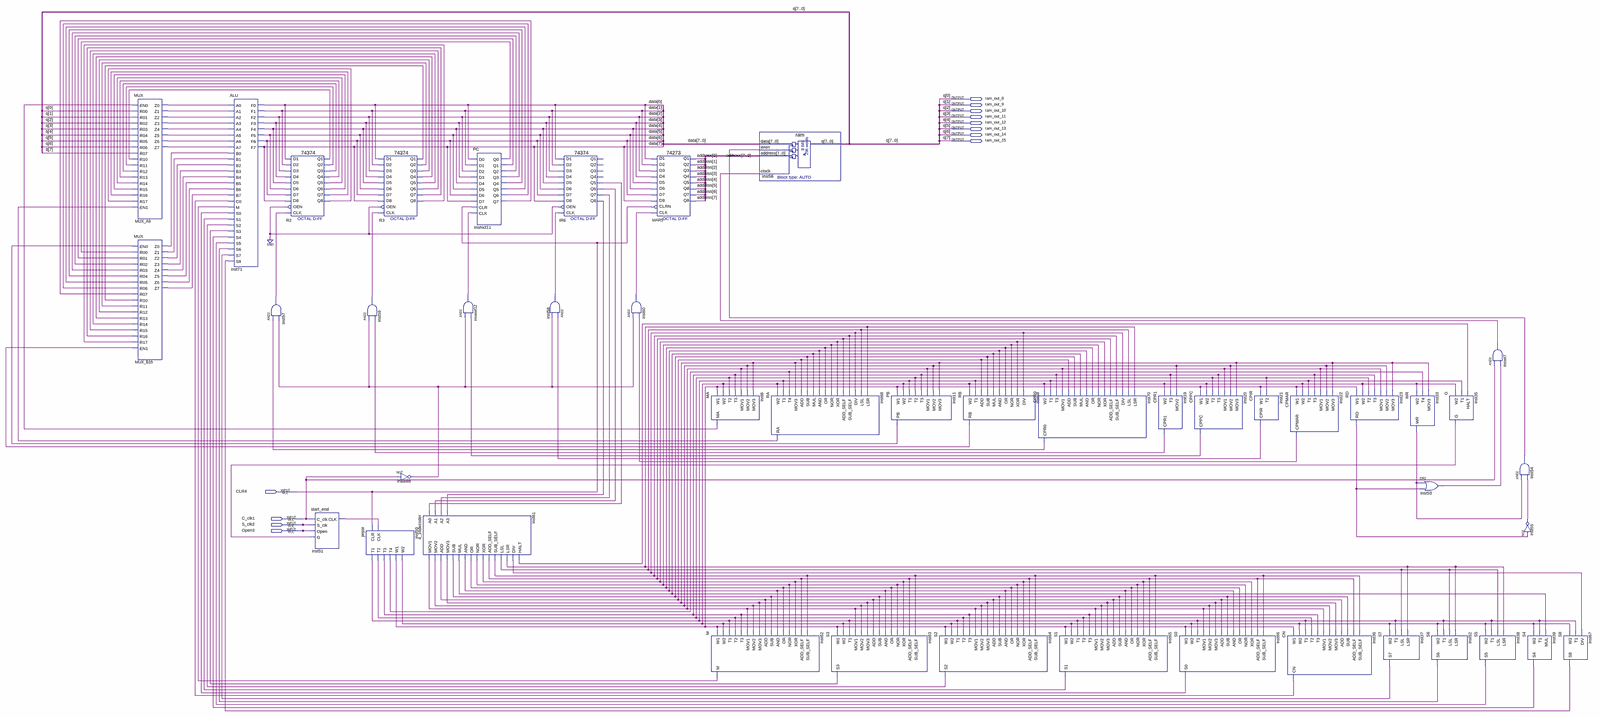
[diagram p0: schematic sheet, whole]
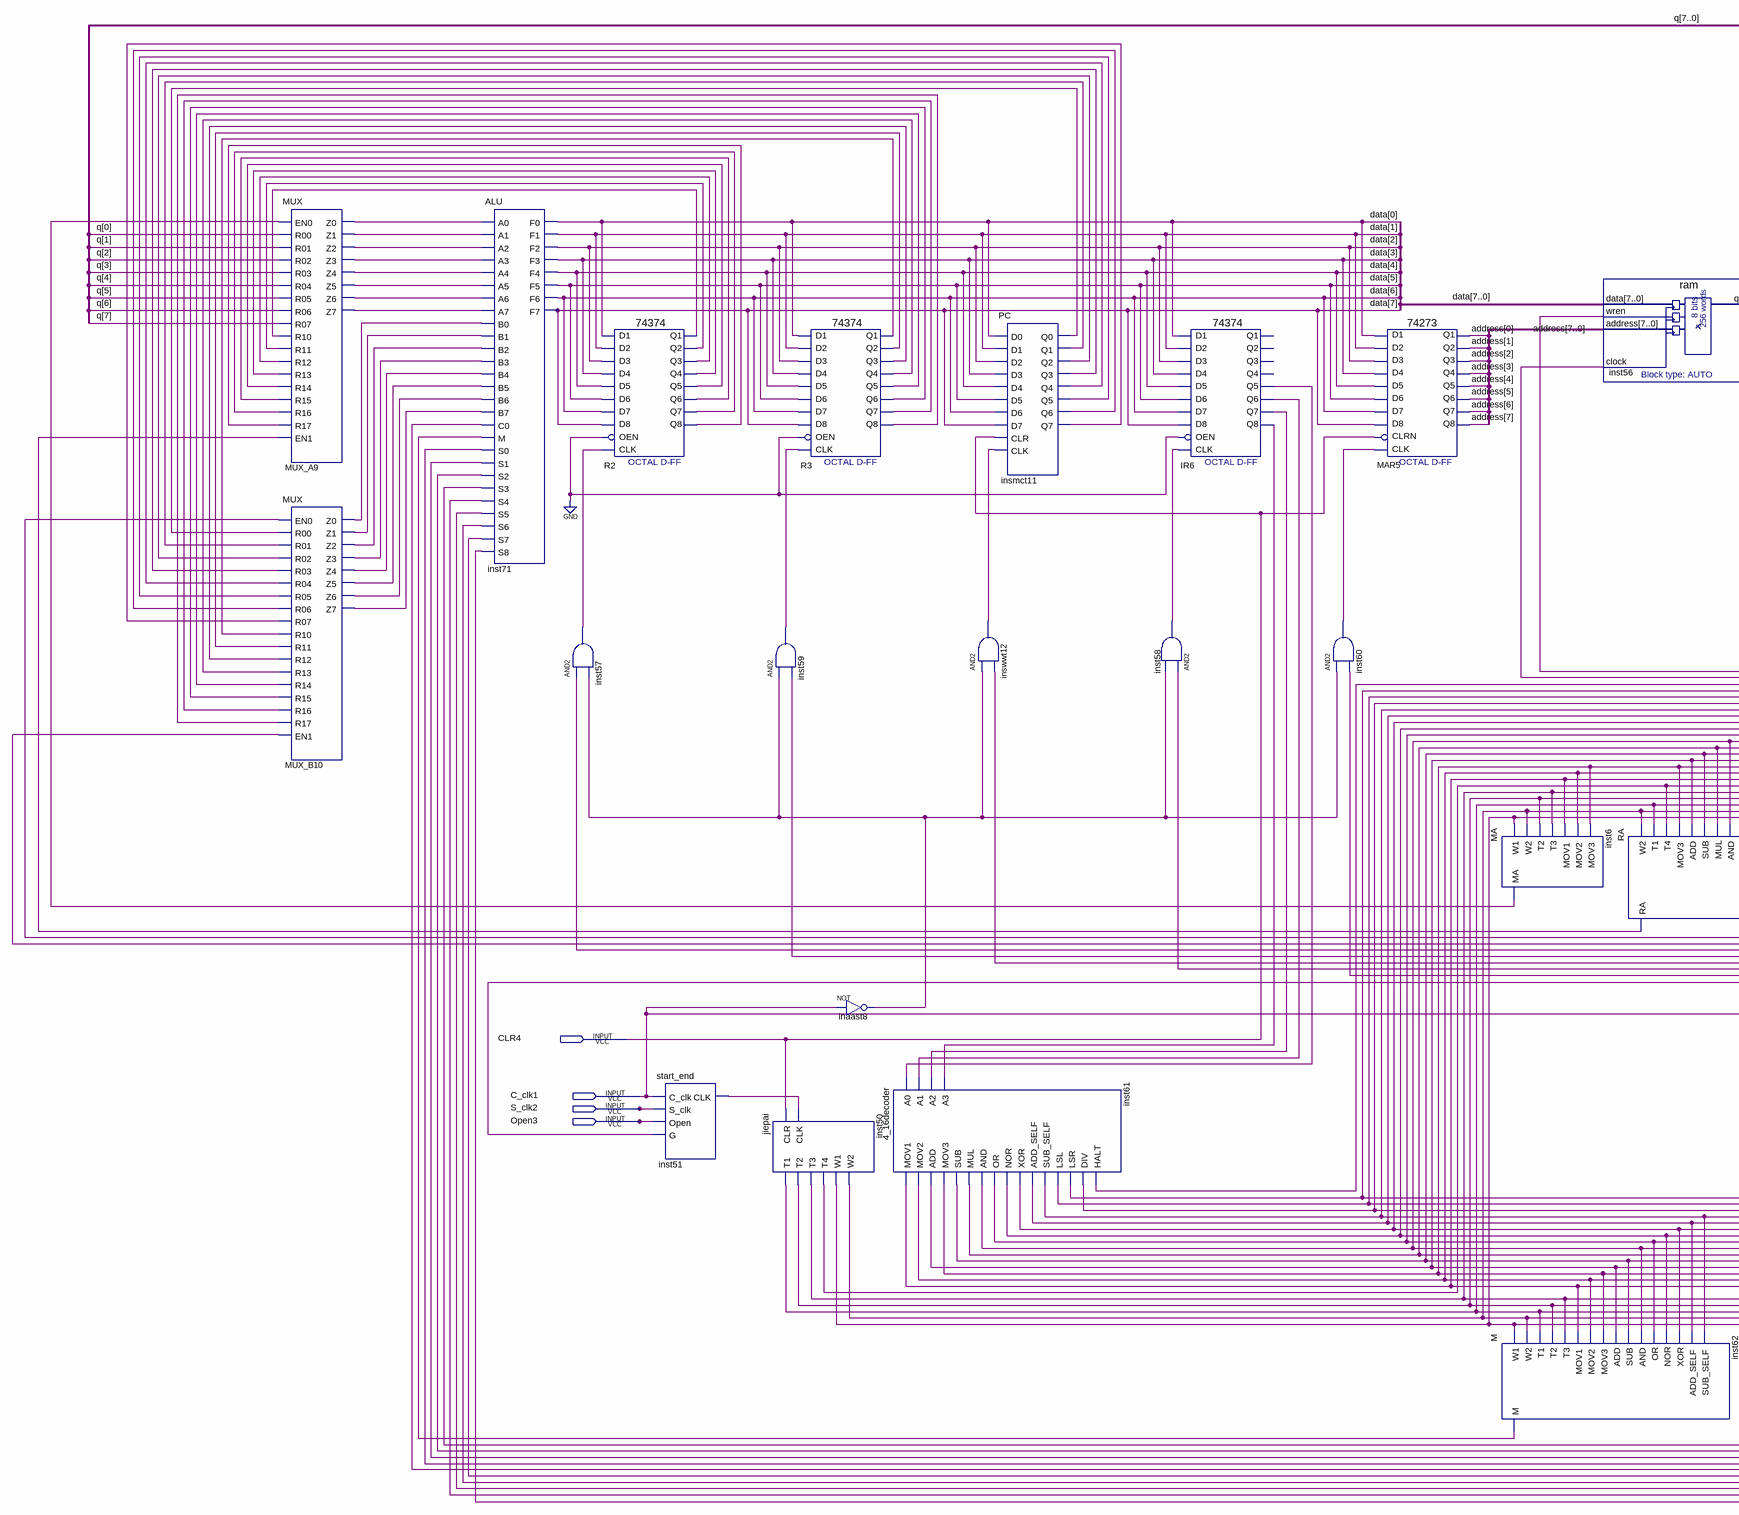
[diagram p1: schematic sheet, left part]
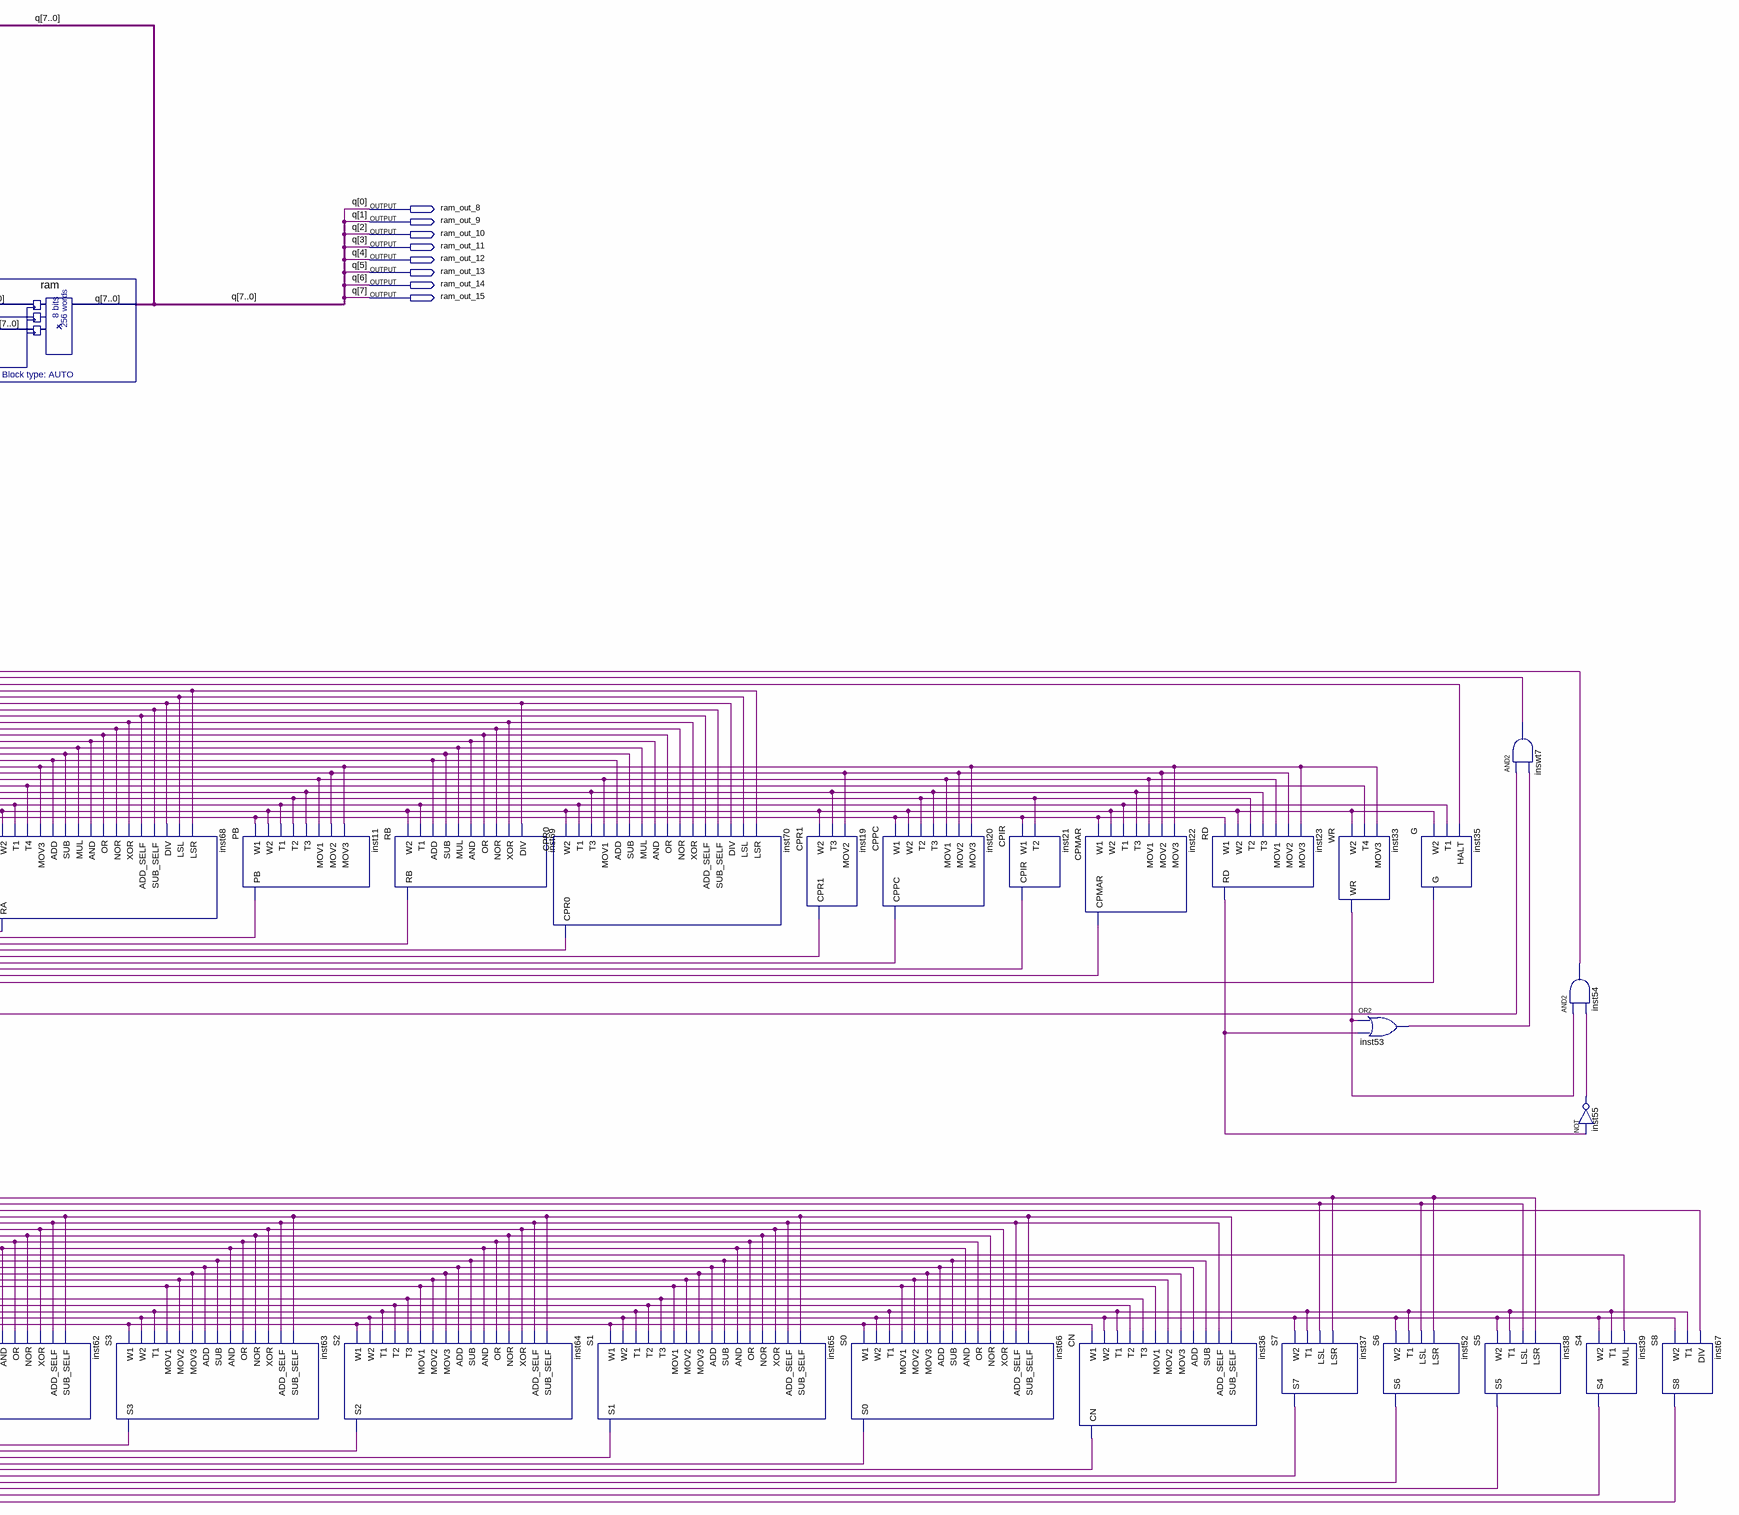
[diagram p2: schematic sheet, right part]
// Quartus schematic Block1.bdf as structural Verilog: 45 symbols, 12 pins
module Block1 (
  input  CLR4,
  input  C_clk1,
  input  S_clk2,
  input  Open3,
  output ram_out_8,
  output ram_out_9,
  output ram_out_10,
  output ram_out_11,
  output ram_out_12,
  output ram_out_13,
  output ram_out_14,
  output ram_out_15
);

  wire inaast8_out, insmct11_q0, insmct11_q1, insmct11_q2, insmct11_q3, insmct11_q4, insmct11_q5,
       insmct11_q6, insmct11_q7, inst6_ma, inst11_pb, inst19_cpr1, inst20_cppc, inst21_cpir, inst22_cpmar,
       inst23_rd, inst33_wr, inst35_g, inst36_cn, inst37_s7, inst38_s5, inst39_s4, inst50_t1, inst50_t2,
       inst50_t3, inst50_t4, inst50_w1, inst50_w2, inst51_clk, inst52_s6, inst53_out, inst54_out, inst55_out,
       inst57_out, inst58_out, inst59_out, inst60_out, inst61_add, inst61_add_self, inst61_and, inst61_div,
       inst61_halt, inst61_lsl, inst61_lsr, inst61_mov1, inst61_mov2, inst61_mov3, inst61_mul, inst61_nor,
       inst61_or, inst61_sub, inst61_sub_self, inst61_xor, inst62_m, inst63_s3, inst64_s2, inst65_s1,
       inst66_s0, inst67_s8, inst68_ra, inst69_rb, inst70_cpr0, inswt7_out, inswwt12_out, IR6_q5, IR6_q6,
       IR6_q7, IR6_q8, MUX_A9_z0, MUX_A9_z1, MUX_A9_z2, MUX_A9_z3, MUX_A9_z4, MUX_A9_z5, MUX_A9_z6,
       MUX_A9_z7, MUX_B10_z0, MUX_B10_z1, MUX_B10_z2, MUX_B10_z3, MUX_B10_z4, MUX_B10_z5, MUX_B10_z6,
       MUX_B10_z7, R2_q1, R2_q2, R2_q3, R2_q4, R2_q5, R2_q6, R2_q7, R2_q8, R3_q1, R3_q2, R3_q3, R3_q4, R3_q5,
       R3_q6, R3_q7, R3_q8;
  wire [7:0] address, data;

  MUX MUX_A9 (
    .EN0(inst6_ma), .R00(ram_out_8), .R01(ram_out_9), .R02(ram_out_10), .R03(ram_out_11), .R04(ram_out_12),
    .R05(ram_out_13), .R06(ram_out_14), .R07(ram_out_15), .R10(R2_q1), .R11(R2_q2), .R12(R2_q3), .R13(R2_q4),
    .R14(R2_q5), .R15(R2_q6), .R16(R2_q7), .R17(R2_q8), .EN1(inst68_ra), .Z0(MUX_A9_z0), .Z1(MUX_A9_z1),
    .Z2(MUX_A9_z2), .Z3(MUX_A9_z3), .Z4(MUX_A9_z4), .Z5(MUX_A9_z5), .Z6(MUX_A9_z6), .Z7(MUX_A9_z7));
  MUX MUX_B10 (
    .EN0(inst11_pb), .R00(insmct11_q0), .R01(insmct11_q1), .R02(insmct11_q2), .R03(insmct11_q3),
    .R04(insmct11_q4), .R05(insmct11_q5), .R06(insmct11_q6), .R07(insmct11_q7), .R10(R3_q1), .R11(R3_q2),
    .R12(R3_q3), .R13(R3_q4), .R14(R3_q5), .R15(R3_q6), .R16(R3_q7), .R17(R3_q8), .EN1(inst69_rb),
    .Z0(MUX_B10_z0), .Z1(MUX_B10_z1), .Z2(MUX_B10_z2), .Z3(MUX_B10_z3), .Z4(MUX_B10_z4), .Z5(MUX_B10_z5),
    .Z6(MUX_B10_z6), .Z7(MUX_B10_z7));
  ALU inst71 (
    .A0(MUX_A9_z0), .A1(MUX_A9_z1), .A2(MUX_A9_z2), .A3(MUX_A9_z3), .A4(MUX_A9_z4), .A5(MUX_A9_z5),
    .A6(MUX_A9_z6), .A7(MUX_A9_z7), .B0(MUX_B10_z0), .B1(MUX_B10_z1), .B2(MUX_B10_z2), .B3(MUX_B10_z3),
    .B4(MUX_B10_z4), .B5(MUX_B10_z5), .B6(MUX_B10_z6), .B7(MUX_B10_z7), .C0(inst36_cn), .M(inst62_m),
    .S0(inst66_s0), .S1(inst65_s1), .S2(inst64_s2), .S3(inst63_s3), .S4(inst39_s4), .S5(inst38_s5),
    .S6(inst52_s6), .S7(inst37_s7), .S8(inst67_s8), .F0(data[0]), .F1(data[1]), .F2(data[2]), .F3(data[3]),
    .F4(data[4]), .F5(data[5]), .F6(data[6]), .F7(data[7]));
  \74374  R2 (
    .D1(data[0]), .D2(data[1]), .D3(data[2]), .D4(data[3]), .D6(data[5]), .D5(data[4]), .OEN(1'b0),
    .D8(data[7]), .D7(data[6]), .CLK(inst57_out), .Q2(R2_q2), .Q3(R2_q3), .Q5(R2_q5), .Q4(R2_q4), .Q6(R2_q6),
    .Q7(R2_q7), .Q8(R2_q8), .Q1(R2_q1));
  and inst57 (inst57_out, inst70_cpr0, inaast8_out);
  start_end inst51 (.C_clk(C_clk1), .S_clk(S_clk2), .Open(Open3), .G(inst35_g), .CLK(inst51_clk));
  jiepai inst50 (
    .CLR(CLR4), .CLK(inst51_clk), .T1(inst50_t1), .T2(inst50_t2), .T3(inst50_t3), .T4(inst50_t4),
    .W1(inst50_w1), .W2(inst50_w2));
  \74374  R3 (
    .D1(data[0]), .D2(data[1]), .D3(data[2]), .D4(data[3]), .D6(data[5]), .D5(data[4]), .OEN(1'b0),
    .D8(data[7]), .D7(data[6]), .CLK(inst59_out), .Q2(R3_q2), .Q3(R3_q3), .Q5(R3_q5), .Q4(R3_q4), .Q6(R3_q6),
    .Q7(R3_q7), .Q8(R3_q8), .Q1(R3_q1));
  and inst59 (inst59_out, inaast8_out, inst19_cpr1);
  not inaast8 (inaast8_out, C_clk1);
  \4_16decoder  inst61 (
    .A0(IR6_q5), .A1(IR6_q6), .A2(IR6_q7), .A3(IR6_q8), .MOV1(inst61_mov1), .MOV2(inst61_mov2),
    .ADD(inst61_add), .MOV3(inst61_mov3), .SUB(inst61_sub), .MUL(inst61_mul), .AND(inst61_and),
    .OR(inst61_or), .NOR(inst61_nor), .XOR(inst61_xor), .ADD_SELF(inst61_add_self),
    .SUB_SELF(inst61_sub_self), .LSL(inst61_lsl), .LSR(inst61_lsr), .DIV(inst61_div), .HALT(inst61_halt));
  PC insmct11 (
    .D0(data[0]), .D1(data[1]), .D2(data[2]), .D3(data[3]), .D4(data[4]), .D5(data[5]), .D6(data[6]),
    .D7(data[7]), .CLR(CLR4), .CLK(inswwt12_out), .Q0(insmct11_q0), .Q1(insmct11_q1), .Q2(insmct11_q2),
    .Q3(insmct11_q3), .Q4(insmct11_q4), .Q5(insmct11_q5), .Q6(insmct11_q6), .Q7(insmct11_q7));
  and inswwt12 (inswwt12_out, inaast8_out, inst20_cppc);
  and inst58 (inst58_out, inst21_cpir, inaast8_out);
  \74374  IR6 (
    .D1(data[0]), .D2(data[1]), .D3(data[2]), .D4(data[3]), .D6(data[5]), .D5(data[4]), .OEN(1'b0),
    .D8(data[7]), .D7(data[6]), .CLK(inst58_out), .Q5(IR6_q5), .Q6(IR6_q6), .Q7(IR6_q7), .Q8(IR6_q8));  // open: Q2, Q3, Q4, Q1
  and inst60 (inst60_out, inaast8_out, inst22_cpmar);
  \74273  MAR5 (
    .D2(data[1]), .D3(data[2]), .D1(data[0]), .D4(data[3]), .D7(data[6]), .D6(data[5]), .D5(data[4]),
    .D8(data[7]), .CLK(inst60_out), .CLRN(CLR4), .Q4(address[3]), .Q1(address[0]), .Q2(address[1]),
    .Q3(address[2]), .Q6(address[5]), .Q5(address[4]), .Q7(address[6]), .Q8(address[7]));
  MA inst6 (
    .W1(inst50_w1), .W2(inst50_w2), .T2(inst50_t2), .T3(inst50_t3), .MOV1(inst61_mov1), .MOV2(inst61_mov2),
    .MOV3(inst61_mov3), .MA(inst6_ma));
  M inst62 (
    .W1(inst50_w1), .W2(inst50_w2), .T1(inst50_t1), .T2(inst50_t2), .T3(inst50_t3), .MOV1(inst61_mov1),
    .MOV2(inst61_mov2), .MOV3(inst61_mov3), .ADD(inst61_add), .SUB(inst61_sub), .AND(inst61_and),
    .OR(inst61_or), .NOR(inst61_nor), .XOR(inst61_xor), .ADD_SELF(inst61_add_self),
    .SUB_SELF(inst61_sub_self), .M(inst62_m));
  ram inst56 (
    .data(data), .wren(inst54_out), .address(address), .clock(inswt7_out),
    .q({ram_out_15, ram_out_14, ram_out_13, ram_out_12, ram_out_11, ram_out_10, ram_out_9, ram_out_8}));
  RA inst68 (
    .W2(inst50_w2), .T1(inst50_t1), .T4(inst50_t4), .MOV3(inst61_mov3), .ADD(inst61_add), .SUB(inst61_sub),
    .MUL(inst61_mul), .AND(inst61_and), .OR(inst61_or), .NOR(inst61_nor), .XOR(inst61_xor),
    .ADD_SELF(inst61_add_self), .SUB_SELF(inst61_sub_self), .DIV(inst61_div), .LSL(inst61_lsl),
    .LSR(inst61_lsr), .RA(inst68_ra));
  S3 inst63 (
    .W1(inst50_w1), .W2(inst50_w2), .T1(inst50_t1), .MOV1(inst61_mov1), .MOV2(inst61_mov2),
    .MOV3(inst61_mov3), .ADD(inst61_add), .SUB(inst61_sub), .AND(inst61_and), .OR(inst61_or),
    .NOR(inst61_nor), .XOR(inst61_xor), .ADD_SELF(inst61_add_self), .SUB_SELF(inst61_sub_self), .S3(inst63_s3));
  PB inst11 (
    .W1(inst50_w1), .W2(inst50_w2), .T1(inst50_t1), .T2(inst50_t2), .T3(inst50_t3), .MOV1(inst61_mov1),
    .MOV2(inst61_mov2), .MOV3(inst61_mov3), .PB(inst11_pb));
  S2 inst64 (
    .W1(inst50_w1), .W2(inst50_w2), .T1(inst50_t1), .T2(inst50_t2), .T3(inst50_t3), .MOV1(inst61_mov1),
    .MOV2(inst61_mov2), .MOV3(inst61_mov3), .ADD(inst61_add), .SUB(inst61_sub), .AND(inst61_and),
    .OR(inst61_or), .NOR(inst61_nor), .XOR(inst61_xor), .ADD_SELF(inst61_add_self),
    .SUB_SELF(inst61_sub_self), .S2(inst64_s2));
  RB inst69 (
    .W2(inst50_w2), .T1(inst50_t1), .ADD(inst61_add), .SUB(inst61_sub), .MUL(inst61_mul), .AND(inst61_and),
    .OR(inst61_or), .NOR(inst61_nor), .XOR(inst61_xor), .DIV(inst61_div), .RB(inst69_rb));
  CPR0 inst70 (
    .W2(inst50_w2), .T1(inst50_t1), .T3(inst50_t3), .MOV1(inst61_mov1), .ADD(inst61_add), .SUB(inst61_sub),
    .MUL(inst61_mul), .AND(inst61_and), .OR(inst61_or), .NOR(inst61_nor), .XOR(inst61_xor),
    .ADD_SELF(inst61_add_self), .SUB_SELF(inst61_sub_self), .DIV(inst61_div), .LSL(inst61_lsl),
    .LSR(inst61_lsr), .CPR0(inst70_cpr0));
  S1 inst65 (
    .W1(inst50_w1), .W2(inst50_w2), .T1(inst50_t1), .T2(inst50_t2), .T3(inst50_t3), .MOV1(inst61_mov1),
    .MOV2(inst61_mov2), .MOV3(inst61_mov3), .ADD(inst61_add), .SUB(inst61_sub), .AND(inst61_and),
    .OR(inst61_or), .NOR(inst61_nor), .XOR(inst61_xor), .ADD_SELF(inst61_add_self),
    .SUB_SELF(inst61_sub_self), .S1(inst65_s1));
  CPR1 inst19 (.W2(inst50_w2), .T3(inst50_t3), .MOV2(inst61_mov2), .CPR1(inst19_cpr1));
  S0 inst66 (
    .W1(inst50_w1), .W2(inst50_w2), .T1(inst50_t1), .MOV1(inst61_mov1), .MOV2(inst61_mov2),
    .MOV3(inst61_mov3), .ADD(inst61_add), .SUB(inst61_sub), .AND(inst61_and), .OR(inst61_or),
    .NOR(inst61_nor), .XOR(inst61_xor), .ADD_SELF(inst61_add_self), .SUB_SELF(inst61_sub_self), .S0(inst66_s0));
  CPPC inst20 (
    .W1(inst50_w1), .W2(inst50_w2), .T2(inst50_t2), .T3(inst50_t3), .MOV1(inst61_mov1), .MOV2(inst61_mov2),
    .MOV3(inst61_mov3), .CPPC(inst20_cppc));
  CPIR inst21 (.W1(inst50_w1), .T2(inst50_t2), .CPIR(inst21_cpir));
  CPMAR inst22 (
    .W1(inst50_w1), .W2(inst50_w2), .T1(inst50_t1), .T3(inst50_t3), .MOV1(inst61_mov1), .MOV2(inst61_mov2),
    .MOV3(inst61_mov3), .CPMAR(inst22_cpmar));
  CN inst36 (
    .W1(inst50_w1), .W2(inst50_w2), .T1(inst50_t1), .T2(inst50_t2), .T3(inst50_t3), .MOV1(inst61_mov1),
    .MOV2(inst61_mov2), .MOV3(inst61_mov3), .ADD(inst61_add), .SUB(inst61_sub), .ADD_SELF(inst61_add_self),
    .SUB_SELF(inst61_sub_self), .CN(inst36_cn));
  RD inst23 (
    .W1(inst50_w1), .W2(inst50_w2), .T2(inst50_t2), .T3(inst50_t3), .MOV1(inst61_mov1), .MOV2(inst61_mov2),
    .MOV3(inst61_mov3), .RD(inst23_rd));
  S7 inst37 (.W2(inst50_w2), .T1(inst50_t1), .LSL(inst61_lsl), .LSR(inst61_lsr), .S7(inst37_s7));
  WR inst33 (.W2(inst50_w2), .T4(inst50_t4), .MOV3(inst61_mov3), .WR(inst33_wr));
  or inst53 (inst53_out, inst33_wr, inst23_rd);
  S6 inst52 (.W2(inst50_w2), .T1(inst50_t1), .LSL(inst61_lsl), .LSR(inst61_lsr), .S6(inst52_s6));
  G inst35 (.W2(inst50_w2), .T1(inst50_t1), .HALT(inst61_halt), .G(inst35_g));
  and inswt7 (inswt7_out, C_clk1, inst53_out);
  S5 inst38 (.W2(inst50_w2), .T1(inst50_t1), .LSL(inst61_lsl), .LSR(inst61_lsr), .S5(inst38_s5));
  and inst54 (inst54_out, inst33_wr, inst55_out);
  not inst55 (inst55_out, inst23_rd);
  S4 inst39 (.W2(inst50_w2), .T1(inst50_t1), .MUL(inst61_mul), .S4(inst39_s4));
  S8 inst67 (.W2(inst50_w2), .T1(inst50_t1), .DIV(inst61_div), .S8(inst67_s8));

  // Other names for the same wires on the sheet: q[7:0] = {ram_out_15, ram_out_14, ram_out_13, ram_out_12, ram_out_11, ram_out_10, ram_out_9, ram_out_8}
endmodule
